# Altium schematic sheet hv_bleed.SchDoc
size A
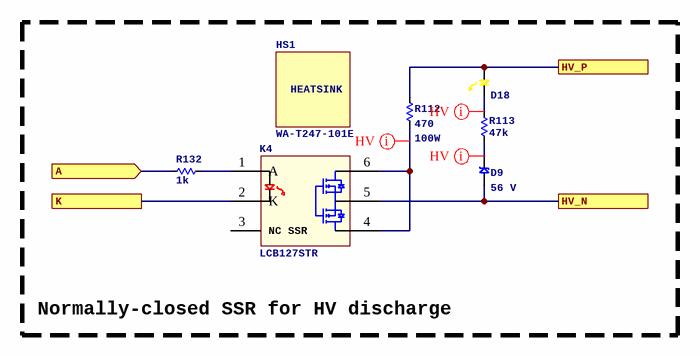
[diagram p0: hv_bleed.SchDoc]

## Parts
D9  Voltage - Zener (Nom) (Vz): 56 V  [SOD323]  (hidden comment: MM3Z56VC)
D18  LTST-C190YKT  [LED_0603P_YELLOW]  (value not drawn)
HS1  WA-T247-101E  [OHMITE_WA-T247-101E]
K4  LCB127STR  [6SMD300]
R112  Resistance (Ohms): 470  Power (Watts): 100W  [TO-247-2_VERTICAL]  (hidden comment: TEH100M470RJE)
R113  value 47k  [R0402]  (hidden comment: 0402WGF4702TCE)
R132  value 1k  [R0402]  (hidden comment: 0402WGF1001TCE)

## Blocks framed on the sheet
Normally-closed SSR for HV discharge: D9 D18 HS1 K4 R112 R113 R132

## Ports
A (in), HV_N, HV_P, K

## Nets
A: R132.2 ; port A
HV_N: D9.1 K4.5 ; port HV_N
HV_P: D18.2 R112.2 ; port HV_P
K: K4.2(K) ; port K
NetD9_2: D9.2 R113.2
NetD18_1: D18.1 R113.1
NetK4_1: K4.1(A) R132.1
NetK4_4: K4.4 K4.6 R112.1

Not connected (* = marked no-connect by the designer): K4 3

## Layout directives
net class HV: NetD9_2, NetD18_1, NetK4_4

## Notes on the sheet
- (in symbol HEATSINK_OHMITE_WA-T247-101E) HEATSINK
- (in symbol SSR_250V_LCB127STR) NC SSR

## Library data of the parts
D9 = ZENER_MM3Z56VC: DIODE ZENER 56V 200MW SOD; Manufacturer: onsemi; Supplier 1: Digikey; Manufacturer Part Number: MM3Z56VC; ComponentLink1URL: https://www.onsemi.com/pdf/datasheet/mm3z9v1c-d.pdf; ComponentLink1Description: Datasheet; Supplier Part Number 1: 488-MM3Z56VCCT-ND; Supplier 2: LCSC; Supplier Part Number 2: C891632
D18 = LED_0603_YELLOW_LTST-C190YKT: LED YELLOW CLEAR 0603 SMD; Manufacturer: Lite-On Inc; Supplier 1: Digikey; ComponentLink1URL: https://mm.digikey.com/Volume0/opasdata/d220001/medias/docus/1176/LTST-C190YKT.pdf; ComponentLink1Description: Datasheet; Supplier Part Number 1: 160-1184-1-ND; Manufacturer Part Number: LTST-C190YKT; Supplier 2: LCSC; Supplier Part Number 2: C125097
HS1 = HEATSINK_OHMITE_WA-T247-101E: Heat Sink, 11ohm, Extruded, Clip, Longitudinal, Aluminum Alloy, Anodized; Manufacturer: Ohmite; Supplier 1: Digikey; Supplier Part Number 1: WA-T247-101E-ND; Manufacturer Part Number: WA-T247-101E; ComponentLink1Description: Datasheet; ComponentLink1URL: https://www.ohmite.com/assets/images/sink-w.pdf
K4 = SSR_250V_LCB127STR: Relay Ssr 50MA 1.4V Dc-in 0.2A 250V Ac/dc-out 6-PIN PDIP SMD T/r; Manufacturer: IXYS; Supplier 1: Digikey; Supplier Part Number 1: 212-LCB127STRCT-ND; Manufacturer Part Number: LCB127STR; ComponentLink1Description: Datasheet; ComponentLink1URL: https://www.littelfuse.com/assetdocs/littelfuse-integrated-circuits-lcb127-datasheet?assetguid=ed9c03ce-9d8a-4952-b2f0-cdedc4b0af1f; Supplier 2: LCSC; Supplier Part Number 2: C6286119
R112 = RES_470_OHM_100W_1%_TO247: RES TK FM 470 OHM 100W 1% TO247; Manufacturer: Ohmite; Supplier 1: Digikey; Manufacturer Part Number: TEH100M470RJE; ComponentLink1URL: http://www.ohmite.com/cat/res_teh100.pdf; ComponentLink1Description: Datasheet; Supplier Part Number 1: TEH100M470RJE-ND; Supplier 2: LCSC; Supplier Part Number 2: C2642463
R113 = 0402WGF4702TCE: Manufacturer: UNI-ROYAL(Uniroyal Elec); Tolerance: 1%; Temperature Coefficient: Â±100ppm/â„ƒ; Power Rating (mW): 62.5; Manufacturer Part Number: 0402WGF4702TCE; ComponentLink1Description: Datasheet; ComponentLink1URL: https://wmsc.lcsc.com/wmsc/upload/file/pdf/v2/lcsc/2206010100_UNI-ROYAL-Uniroyal-Elec-0402WGF4702TCE_C25792.pdf; Package: 0402; Supplier 2: LCSC; Supplier Part Number 2: C25792
R132 = 0402WGF1001TCE: Manufacturer: UNI-ROYAL(Uniroyal Elec); Tolerance: 1%; Temperature Coefficient: Â±100ppm/â„ƒ; Power Rating (mW): 62.5; ComponentLink1Description: Datasheet; ComponentLink1URL: https://wmsc.lcsc.com/wmsc/upload/file/pdf/v2/lcsc/2206010216_UNI-ROYAL-Uniroyal-Elec-0402WGF1001TCE_C11702.pdf; Manufacturer Part Number: 0402WGF1001TCE; Package: 0402; Supplier 2: LCSC; Supplier Part Number 2: C11702